# EAGLE design PeakShaver (EAGLE 9.5.0)
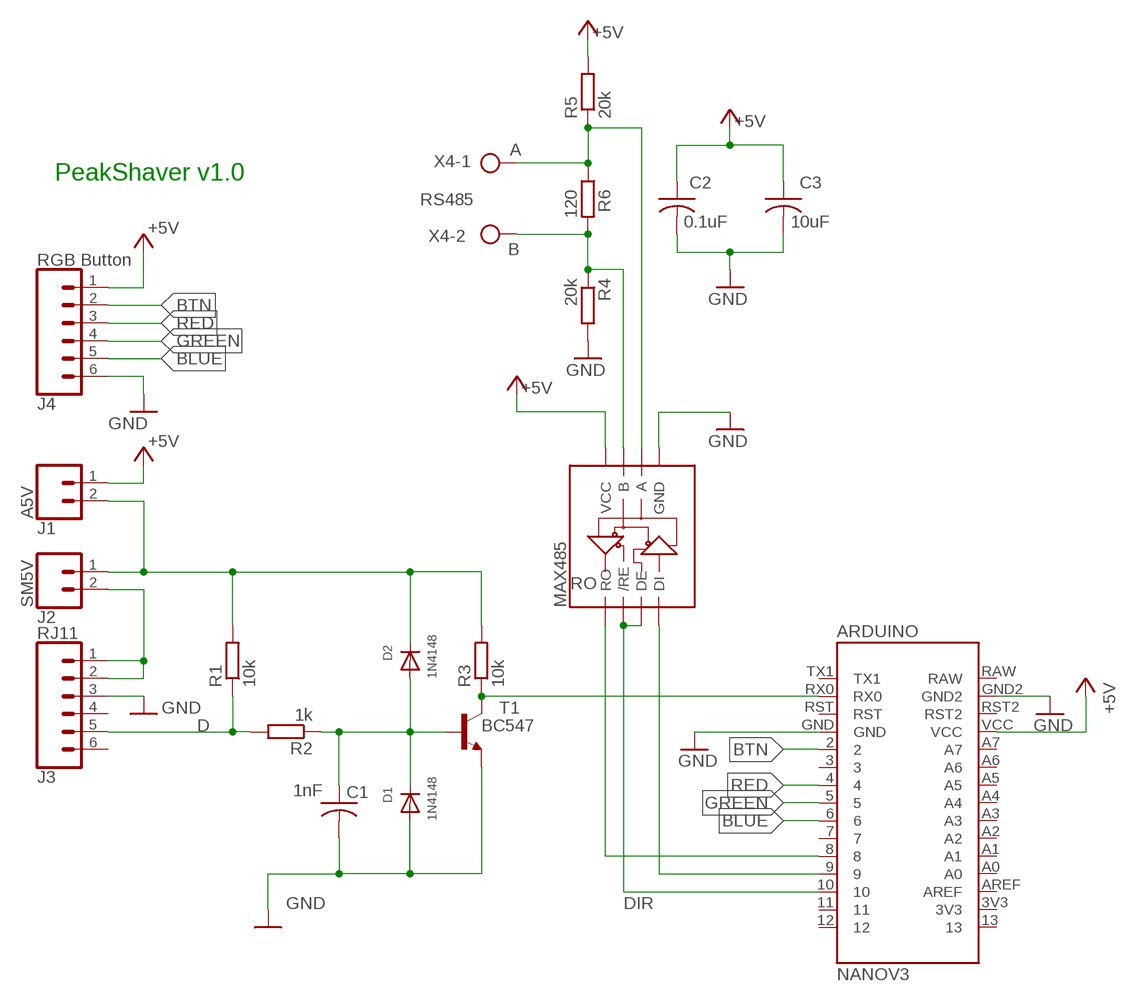
[diagram p0: schematic, sheet 1]

## Parts
ARDUINO  NANOV3  [NANOV3]
C1  1nF  C-US025-025X050  [C025-025X050]
C2  0.1uF  C-US025-025X050  [C025-025X050]
C3  10uF  ECA-1HM100  [CAP_RADIAL_2MM]
D1  1N4148  DIODEDO-1N4148  [DO-1N4148]
D2  1N4148  DIODEDO-1N4148  [DO-1N4148]
J1  A5V  CONN_02  [1X02]
J2  SM5V  CONN_02  [1X02]
J3  RJ11  RJ11-6  [RJ11-6]
J4  RGB Button  CONN_06LOCK  [1X06_LOCK]
MAX485  SPARKFUN-IC-COMMS_RS485  [TEXAS_DIL08]
R1  10k  R-EU_0207/10  [0207/10]
R2  1k  R-EU_0207/10  [0207/10]
R3  10k  R-EU_0207/10  [0207/10]
R4  20k  R-EU_0207/10  [0207/10]
R5  20k  R-EU_0207/10  [0207/10]
R6  120  R-EU_0207/10  [0207/10]
T1  BC547  [TO92]
X4  RS485  W237-102  [W237-102]

## Nets
+5V [PWR]: ARDUINO.VCC C2.1 C3.1 J1.1 J4.1 MAX485.8(VCC) R5.2
A: MAX485.6(A) R5.1 R6.1 X4.1
B: MAX485.7(B) R4.1 R6.2 X4.2
BASE [PWR]: C1.1 D1.C D2.A R2.1 T1.2(B)
BLUE: ARDUINO.6 J4.5
BTN: ARDUINO.2 J4.2
D [PWR]: J3.5 R1.1 R2.2
DI: ARDUINO.9 MAX485.4(DI)
DIR: ARDUINO.10 MAX485.2(/RE) MAX485.3(DE)
GND [GND]: ARDUINO.GND ARDUINO.GND2 C1.2 C2.2 C3.2 D1.A J3.3 J4.6 MAX485.5(GND) R4.2 T1.1(E)
GREEN: ARDUINO.5 J4.4
N$1 [PWR]: D2.C J1.2 J2.1 R1.2 R3.2
RED: ARDUINO.4 J4.3
RO: ARDUINO.8 MAX485.1(RO)
RTS [PWR]: J2.2 J3.1 J3.2
RX: ARDUINO.RX0 R3.1 T1.3(C)
Unconnected: ARDUINO.3 ARDUINO.3V3 ARDUINO.7 ARDUINO.11 ARDUINO.12 ARDUINO.13 ARDUINO.A0 ARDUINO.A1 ARDUINO.A2 ARDUINO.A3 ARDUINO.A4 ARDUINO.A5 ARDUINO.A6 ARDUINO.A7 ARDUINO.AREF ARDUINO.RAW ARDUINO.RST ARDUINO.RST2 ARDUINO.TX1 J3.4 J3.6

## Notes on the sheet
- PeakShaver v1.0

## Library data of the parts
ARDUINO = Arduino Nano by Jazz:NANOV3
C1 C2 = BeagleBone_Black_Wireless:C-US: CAPACITOR, American symbol
C3 = Resistor_Capacitor:ECA-1HM100: CAP ALUM 10UF 20% 50V RADIAL Manufacturer's datasheet <https://media.digikey.com/pdf/Data%20Sheets/Panasonic%20Electronic%20Components/ECA-xxM%20Series,TypeA.pdf>; CREATED_BY: PCBLayout.com; DIGIKEY_PART_NUMBER: P5178-ND; MANUFACTURER: Panasonic Electronic Components; MPN: ECA-1HM100; PACKAGE: CAP RADIAL 2MM LS
D1 D2 = adafruit:DIODE: Diode SMADIODE - SMA Surface Mount Package 20V 1A Schottky Diode Digikey: 641-1014-6-ND DO-1N4148 - Through Hole Small Current Diode SOD-123 20V 1 A (.5mV Vf) Schottky Diode - Digikey: MBRX120TPMSCT-ND SOD-323 10V 570mA (.38mV Vf, 3ns) Schottky Diode - Digikey: ZLLS410CT-ND SOD-523 30V 30mA Schottky Diode (RB751S-40TE61) - Digikey: RB751S-40TE61CT-ND SOT23-R/W - SOT23 Package (R = Solder Paste/Reflow Ovens, W = Hand-Soldering) BAT54Film 40V 300mA - Digikey: 497-7162-1-ND
J1 J2 = SparkFun-Connectors:CONN_02: Multi connection point. Often used as Generic Header-pin footprint for 0.1 inch spaced/style header connections On any of the 0.1 inch spaced packages, you can populate with these: Break Away Headers - Straight <https://www.sparkfun.com/products/116> (PRT-00116) Break Away Male Headers - Right Angle <https://www.sparkfun.com/products/553> (PRT-00553) Female Headers <https://www.sparkfun.com/products/115> (PRT-00115) Break Away Headers - Machine Pin <https://www.sparkfun.com/products/117> (PRT-00117) Break Away Female Headers - Swiss Machine Pin <https://www.sparkfun.com/products/743> (PRT-00743) For SCREWTERMINALS and SPRING TERMINALS visit here: Screw Terimnals on SparkFun.com <https://www.sparkfun.com/search/results?term=Screw+Terminals> (5mm/3.5mm/2.54mm spacing) This device is also useful as a general connection point to wire up your design to another part of your project. Our various solder wires solder well into these plated through hole pads. Hook-Up Wire - Assortment (Stranded, 22 AWG) <https://www.sparkfun.com/products/11375> (PRT-11375) Hook-Up Wire - Assortment (Solid Core, 22 AWG) <https://www.sparkfun.com/products/11367> (PRT-11367) View the entire wire category on our website here <https://www.sparkfun.com/categories/141> Special notes: Molex polarized connector foot print use with: PRT-08233 with associated crimp pins and housings. 2.54_SCREWTERM for use with PRT-10571. 3.5mm Screw Terminal footprints for PRT-08084 5mm Screw Terminal footprints for use with PRT-08432
J3 = SparkFun-Connectors:RJ11-6: RJ11 Jack - 6 pin Commonly found on CAT3 devices and some Microchip programmers. Here is the connector we sell at SparkFun: RJ11 6-Pin Connector <https://www.sparkfun.com/products/132> (PRT-00132) Datasheet <http://www.sparkfun.com/datasheets/Prototyping/Connectors/RJ11-Datasheet.pdf> It is used on this SparkFun product: SparkFun Weather Shield <https://www.sparkfun.com/products/12081> (DEV-12081) Weather Meters <https://www.sparkfun.com/products/8942> (SEN-08942); PROD_ID: CONN-08590; SF_ID: PRT-00132
J4 = SparkFun-Connectors:CONN_06: Multi connection point. Often used as Generic Header-pin footprint for 0.1 inch spaced/style header connections On any of the 0.1 inch spaced packages, you can populate with these: Break Away Headers - Straight <https://www.sparkfun.com/products/116> (PRT-00116) Break Away Male Headers - Right Angle <https://www.sparkfun.com/products/553> (PRT-00553) Female Headers <https://www.sparkfun.com/products/115> (PRT-00115) Break Away Headers - Machine Pin <https://www.sparkfun.com/products/117> (PRT-00117) Break Away Female Headers - Swiss Machine Pin <https://www.sparkfun.com/products/743> (PRT-00743) Arduino Stackable Header - 6 Pin <https://www.sparkfun.com/products/9280> (PRT-09280) For SCREWTERMINALS and SPRING TERMINALS visit here: Screw Terimnals on SparkFun.com <https://www.sparkfun.com/search/results?term=Screw+Terminals> (5mm/3.5mm/2.54mm spacing) This device is also useful as a general connection point to wire up your design to another part of your project. Our various solder wires solder well into these plated through hole pads. Hook-Up Wire - Assortment (Stranded, 22 AWG) <https://www.sparkfun.com/products/11375> (PRT-11375) Hook-Up Wire - Assortment (Solid Core, 22 AWG) <https://www.sparkfun.com/products/11367> (PRT-11367) View the entire wire category on our website here <https://www.sparkfun.com/categories/141>
MAX485 = evse_nano:SPARKFUN-IC-COMMS_RS485: RS-485 Transceiver SP3485 Series 8 Pin NSOIC 3.3 V Low Power Half Duplex RS-485 Transceiver MAX3485 compatible Datasheet <http://www.sparkfun.com/datasheets/Components/General/sp3485CN-LTR.pdf> SparkFun Products SparkFun Transceiver Breakout - RS-485 <https://www.sparkfun.com/products/10124> (BOB-10124) SparkFun USB to RS-485 Converter <https://www.sparkfun.com/products/9822> (BOB-09822)
R1-R6 = resistor:R-EU_: RESISTOR, European symbol
T1 = transistor-neu-to92:BC547: NPN TRANSISTOR
X4 = con-wago-500:W237-102: WAGO SCREW CLAMP; MPN: 237-102; OC_FARNELL: unknown; OC_NEWARK: 70K9898

## Net classes
0 default: width 1.016 mm, drill 0.508 mm, clearance 0.254 mm
1 GND: width 1.016 mm, drill 0.508 mm, clearance 0.254 mm
4 PWR: width 1.016 mm, drill 0.508 mm, clearance 0.254 mm to class 2, clearance 0.254 mm

## Board
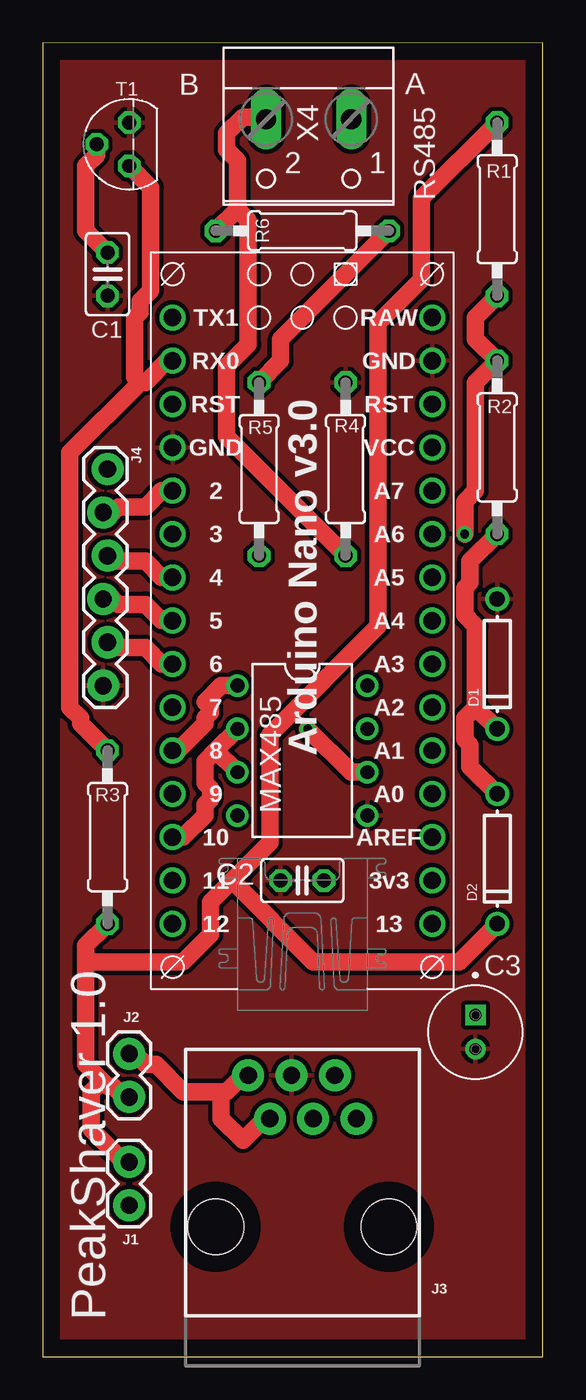
[diagram p1: board, top side]
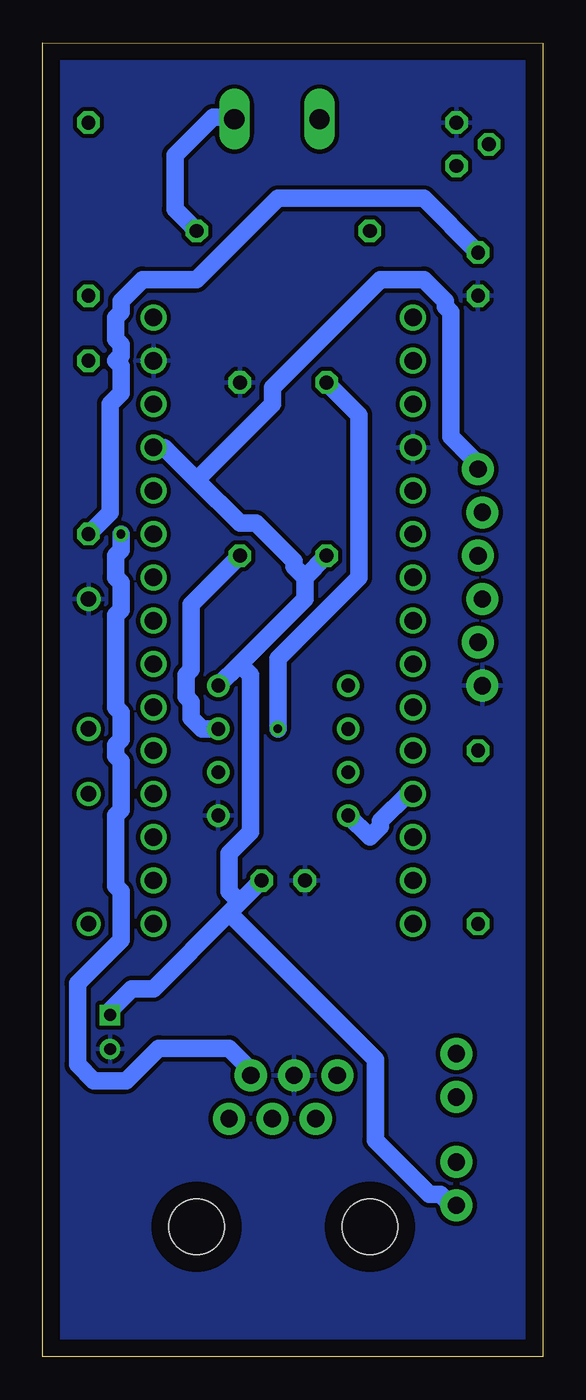
[diagram p2: board, bottom side, seen from below]

Size 29.36 x 77.08 mm. Coordinates in mm from the lower left corner, seen from the top.
Outline: 0,0 29.36,0 29.36,77.08 0,77.05 0,0
Copper layers (1*16): Top 0.035mm / dielectric 1.5mm / Bottom 0.035mm
Design rules "default": minimum track width 6mil, minimum drill 0.35mm, track to track 6mil, track to pad 6mil, pad to pad 6mil, via to via 6mil, smd to smd 6mil, copper to edge 40mil, drill to drill 6mil, minimum pad ring 10mil, minimum via ring 8mil, stop-mask expansion 4mil, vias tented up to drill 0mil, thermal gap 10mil

### Footprints (pad centres in the part's own frame; a part is rotated, then mirrored left to right if it is on the bottom)
NANOV3 = drill 1.016: 2 -7.62,5.08; 3 -7.62,2.54; 3V3 7.62,-17.78; 4 -7.62,0; 5 -7.62,-2.54; 6 -7.62,-5.08; 7 -7.62,-7.62; 8 -7.62,-10.16; 9 -7.62,-12.7; 10 -7.62,-15.24; 11 -7.62,-17.78; 12 -7.62,-20.32; 13 7.62,-20.32; A0 7.62,-12.7; A1 7.62,-10.16; A2 7.62,-7.62; A3 7.62,-5.08; A4 7.62,-2.54; A5 7.62,0; A6 7.62,2.54; A7 7.62,5.08; AREF 7.62,-15.24; GND -7.62,7.62; GND2 7.62,12.7; RAW 7.62,15.24; RST -7.62,10.16; RST2 7.62,10.16; RX0 -7.62,12.7; TX1 -7.62,15.24; VCC 7.62,7.62
C025-025X050 = drill 0.813 octagon: 1 -1.27,0; 2 1.27,0
CAP_RADIAL_2MM = drill 0.7 pad 1.1 square: 1 -1,0 | drill 0.7 pad 1.1: 2 1,0
DO-1N4148 = drill 0.9: A -3.81,0; C 3.81,0
1X02 = drill 1.016 pad 1.88: 1 0,0; 2 2.54,0
RJ11-6 = drill 1.016 pad 1.88: 1 -3.175,8.89; 2 -1.905,6.35; 3 -0.635,8.89; 4 0.635,6.35; 5 1.905,8.89; 6 3.175,6.35 | hole 3.251: -5.08,0; 5.08,0
1X06_LOCK = drill 1.016 pad 1.88: 1 0,0; 2 2.54,-0.254; 3 5.08,0; 4 7.62,-0.254; 5 10.16,0; 6 12.7,-0.254
TEXAS_DIL08 = drill 0.813 pad 1.27: 1 -3.81,-3.81; 2 -1.27,-3.81; 3 1.27,-3.81; 4 3.81,-3.81; 5 3.81,3.81; 6 1.27,3.81; 7 -1.27,3.81; 8 -3.81,3.81
0207/10 = drill 0.813 octagon: 1 -5.08,0; 2 5.08,0
TO92 = drill 0.813 octagon: 1 1.27,0; 2 0,1.905; 3 -1.27,0
W237-102 = drill 1.194 long: 1 -2.5,-1.27; 2 2.5,-1.27

### Placement (x,y rotation side)
ARDUINO  15.24,45.72 0 top
C1  3.81,63.5 270 top
C2  15.24,27.94 180 top
C3  25.4,19.05 270 top
D1  26.67,40.64 270 top
D2  26.67,29.21 270 top
J1  5.08,8.89 90 top
J2  5.08,15.24 90 top
J3  15.24,7.62 0 top
J4  3.81,52.07 270 top
MAX485  15.24,35.56 270 top
R1  26.67,67.31 90 top
R2  26.67,53.34 90 top
R3  3.81,30.48 270 top
R4  17.78,52.07 90 top
R5  12.7,52.07 270 top
R6  15.24,66.04 180 top
T1  5.08,71.12 90 top
X4  15.61,71.32 180 top

### Tracks (layer width: path | path; a pad name or v marks a point on that pad's centre or on a via)
+5V
  Bottom 1.016: C2.1 17.78,26.67 | 17.78,26.67 18.41,26.04 | 18.41,26.04 22.86,21.59 24.13,21.59 25.4,20.32 C3.1 | J1.1 5.4,8.89 6.03,9.53 6.67,9.53 9.84,12.7 9.84,17.46 18.41,26.04 | 17.78,40.64 13.97,44.45 13.97,45.72 | 17.78,40.64 MAX485.8 | R5.2 13.97,45.72 | ARDUINO.VCC 22.23,53.34 20.32,51.44 | 20.32,51.44 17.78,48.9 16.83,48.9 14.61,46.67 14.61,46.36 13.97,45.72 | J4.1 3.81,52.39 5.4,53.98 5.4,61.28 5.72,61.6 5.72,61.91 6.98,63.18 9.53,63.18 15.88,56.83 15.88,55.88 20.32,51.44 | 17.78,26.67 18.41,27.3 18.41,29.53 17.15,30.8 17.15,40.01 17.78,40.64
A  (via drill 0.51)
  Top 1.016: MAX485.6 18.1,34.29 v15.56,36.83 | R6.1 13.97,59.69 13.97,58.42 R5.1
  Bottom 1.016: R6.1 21.59,67.31 21.59,70.48 19.37,72.71 18.41,72.71 X4.1 | v15.56,36.83 15.56,40.96 10.8,45.72 10.8,55.25 R5.1
B
  Top 1.016: 11.43,67.31 R6.2 | 11.43,67.31 11.43,70.17 10.8,70.8 10.8,71.75 11.75,72.71 13.02,72.71 X4.2 | R4.1 10.8,53.98 10.8,58.1 12.07,59.37 12.07,66.67 11.43,67.31
  Bottom 1.016: MAX485.7 20,36.83 20.64,37.47 20.64,38.42 20.96,38.74 20.96,40.01 20.64,40.32 20.64,44.13 R4.1
BASE
  Top 1.016: C1.1 2.54,66.04 2.54,69.85 3.18,70.48 T1.2 | R2.1 25.08,46.67 25.08,45.4 24.77,45.09 24.77,43.5 25.4,42.86 25.4,38.1 | D1.C 25.4,38.1 | D2.A 25.08,34.61 25.08,35.88 24.77,36.2 24.77,37.47 25.4,38.1
  Bottom 1.016: C1.1 6.98,67.94 15.56,67.94 20.32,63.18 23.5,63.18 24.77,61.91 24.77,61.28 25.08,60.96 25.08,59.69 24.77,59.37 24.77,58.74 25.08,58.42 24.77,58.1 24.77,56.52 25.4,55.88 25.4,49.53 R2.1
BLUE
  Top 1.016: ARDUINO.6 6.98,40.64 6.03,41.59 4.45,41.59 4.13,41.91 J4.5
BTN
  Top 1.016: ARDUINO.2 6.98,50.8 6.03,49.85 4.45,49.85 3.81,49.21 3.49,49.53 J4.2
D  (via drill 0.51)
  Top 1.016: R1.1 25.4,60.96 25.4,59.69 R2.2 25.4,57.15 25.4,50.8 24.77,50.17 v24.77,48.26
  Bottom 1.016: J3.5 17.15,16.83 18.41,18.1 22.54,18.1 24.45,16.19 26.35,16.19 27.3,17.14 27.3,21.91 24.77,24.45 24.77,27.3 25.08,27.62 25.08,31.75 24.77,32.07 24.77,34.93 25.08,35.24 25.08,35.88 24.77,36.2 24.77,37.78 25.08,38.1 25.08,43.5 24.77,43.82 24.77,45.4 25.08,45.72 25.08,46.99 24.77,47.31 v24.77,48.26
DI
  Bottom 1.016: MAX485.4 10.16,30.48 9.53,31.11 9.53,31.43 7.94,33.02 ARDUINO.9
DIR
  Top 1.016: 10.16,35.56 MAX485.3 | MAX485.2 10.16,35.56 | ARDUINO.10 8.26,30.48 9.53,31.75 9.53,32.38 9.84,32.7 9.84,33.34 9.53,33.66 9.53,34.93 10.16,35.56
GND
  pour Top: -5.08,-3.83 -5.08,78.74 36.83,78.74 36.83,-3.86
  pour Bottom: -4.21,79.67 34.6,79.7 34.6,-1.44 -3.15,-1.44
GREEN
  Top 1.016: ARDUINO.5 6.98,43.18 6.03,44.13 4.45,44.13 3.81,44.77 3.49,44.45 J4.4
N$1
  Top 1.016: R3.2 2.54,24.13 2.54,23.18 | 2.54,23.18 2.54,17.14 3.49,16.19 | 3.49,16.19 3.81,15.88 4.13,15.88 4.76,15.24 J2.1 | R1.2 22.23,67.94 22.23,63.18 19.69,60.64 19.69,42.86 13.34,36.51 13.34,30.16 11.11,27.94 | 11.11,27.94 9.84,26.67 9.84,24.77 8.26,23.18 2.54,23.18 | D2.C 24.45,23.18 15.88,23.18 11.11,27.94 | J1.2 4.76,11.43 2.86,13.33 2.86,15.56 3.49,16.19
RED
  Top 1.016: ARDUINO.4 6.98,45.72 6.03,46.67 4.45,46.67 4.13,46.99 J4.3
RO
  Top 1.016: MAX485.1 10.48,39.37 9.53,38.42 9.84,38.1 9.84,37.78 9.53,37.47 9.53,37.15 7.94,35.56 ARDUINO.8
RTS
  Top 1.016: J2.2 5.4,17.78 6.03,17.14 6.67,17.14 8.26,15.56 10.48,15.56 | 10.48,15.56 10.8,15.56 11.75,16.51 J3.1 | J3.2 13.02,13.97 11.75,12.7 10.48,13.97 10.48,15.56
RX
  Top 1.016: R3.1 2.22,37.15 2.22,37.47 1.59,38.1 1.59,53.02 5.72,57.15 | 5.72,57.15 6.03,57.15 7.3,58.42 ARDUINO.RX0 | T1.3 6.35,68.58 6.35,62.55 5.72,61.91 5.72,61.28 5.4,60.96 5.4,57.47 5.72,57.15

### Text on the board
tNames: PeakShaver 1.0
bValues: www.github.com/ajvdw